# Altium schematic sheet RS485.SchDoc
size 420 x 297 mm; Revision: 1.1.0; SheetNumber: 9; SheetTotal: 15
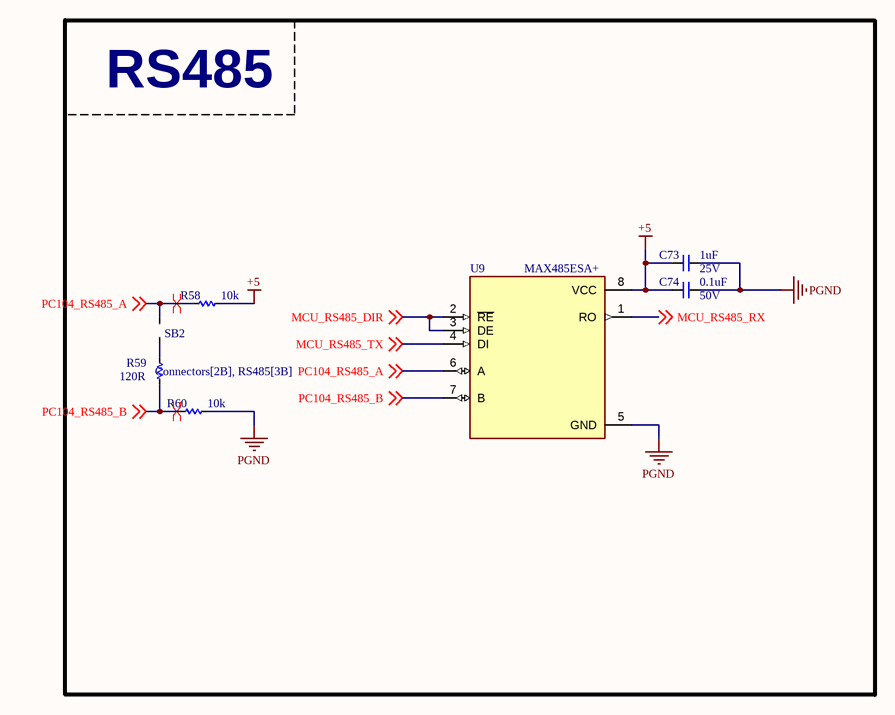
[diagram p0: RS485.SchDoc]

## Parts
C73  1uF  Voltage: 25V  [CAP_C_1608X80]
C74  0.1uF  Voltage: 50V  [CAP_C_1608X80]
R58  10k  [RES_C_1608X60]
R59  120R  [RES_C_1608X60]
R60  10k  [RES_C_1608X60]
SB2  N/A  [JUMPER_1608]  (value not drawn)
U9  MAX485ESA+  [SOIC127]

## Blocks framed on the sheet
RS485: C73 C74 R58-R60 SB2 U9

## Nets
+5: C73.2 C74.2 R58.2 U9.8(VCC)
PGND: C73.1 C74.1 R60.2 U9.5(GND)
MCU_RS485_DIR: U9.2(~{RE}) U9.3(DE) ; off-sheet MCU_RS485_DIR
MCU_RS485_RX: U9.1(RO) ; off-sheet MCU_RS485_RX
MCU_RS485_TX: U9.4(DI) ; off-sheet MCU_RS485_TX
PC104_RS485_A: R58.1 SB2.2 U9.6(A) ; off-sheet PC104_RS485_A
PC104_RS485_B: R59.1 R60.1 U9.7(B) ; off-sheet PC104_RS485_B
NetR59_2: R59.2 SB2.1

## Layout directives
differential pair: PC104_RS485_A, PC104_RS485_B

## Notes on the sheet
- Project:
- DAL_PDU
- Sub-system:
- IGRVT-50
- Design by:
- KIEN HOANG
- BAO BUI
- Sheet title:
- Sheet
- A3
- of
- Checked by:
- Approved by:
- VU PHAM
- Revision:
- Document No:
- Size:
- Date:

## Library data of the parts
C73 C74 = _CAP_C_2: CAP
R58-R60 = _RES_B_2_2: RES
SB2 = JUMPER